# Altium project Tag201_GangProgrammerRev2.PrjPCB
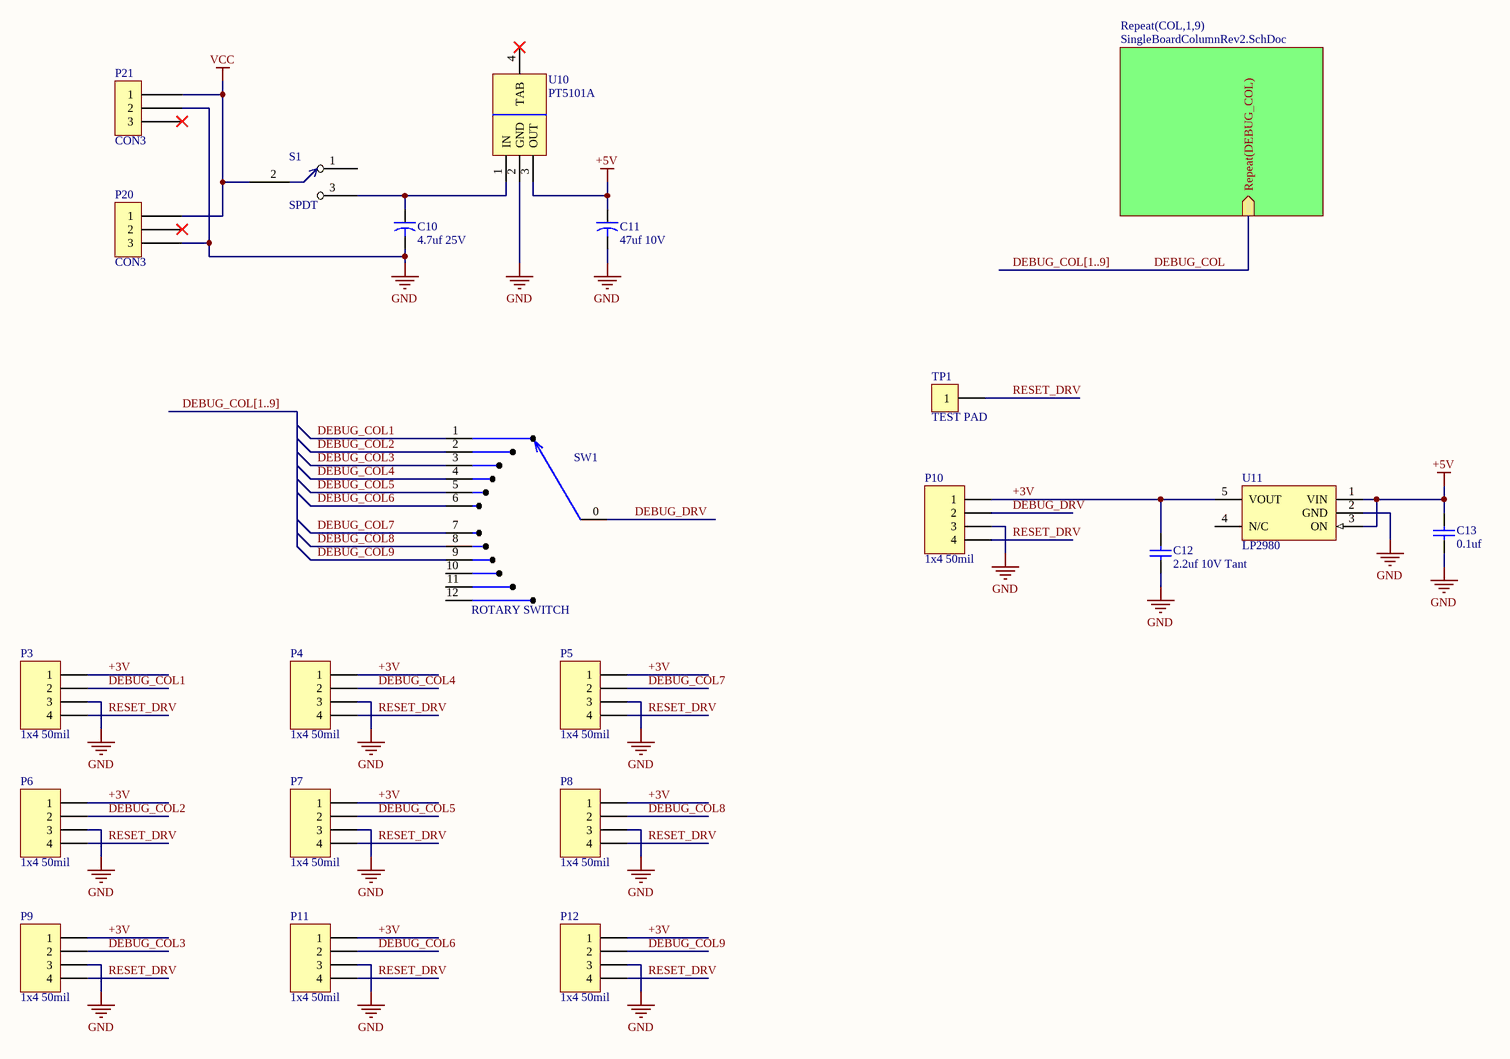
[diagram p0: Tag201_GangProgrammerRev2.SchDoc]
3 sheets, 831 parts. Net scope: hierarchical (ports join the sheet entries above them; power ports are global).
Board file: Tag201_GangProgrammerRev2.PcbDoc
Sheets:
  Tag201_GangProgrammerRev2.SchDoc
    COL1 = SingleBoardColumnRev2.SchDoc
      ROW1 = SingleBoardCircuitRev2.SchDoc
      ROW2 = SingleBoardCircuitRev2.SchDoc
      ROW3 = SingleBoardCircuitRev2.SchDoc
      ROW4 = SingleBoardCircuitRev2.SchDoc
      ROW5 = SingleBoardCircuitRev2.SchDoc
      ROW6 = SingleBoardCircuitRev2.SchDoc
    COL2 = SingleBoardColumnRev2.SchDoc
      ROW1 = SingleBoardCircuitRev2.SchDoc
      ROW2 = SingleBoardCircuitRev2.SchDoc
      ROW3 = SingleBoardCircuitRev2.SchDoc
      ROW4 = SingleBoardCircuitRev2.SchDoc
      ROW5 = SingleBoardCircuitRev2.SchDoc
      ROW6 = SingleBoardCircuitRev2.SchDoc
    COL3 = SingleBoardColumnRev2.SchDoc
      ROW1 = SingleBoardCircuitRev2.SchDoc
      ROW2 = SingleBoardCircuitRev2.SchDoc
      ROW3 = SingleBoardCircuitRev2.SchDoc
      ROW4 = SingleBoardCircuitRev2.SchDoc
      ROW5 = SingleBoardCircuitRev2.SchDoc
      ROW6 = SingleBoardCircuitRev2.SchDoc
    COL4 = SingleBoardColumnRev2.SchDoc
      ROW1 = SingleBoardCircuitRev2.SchDoc
      ROW2 = SingleBoardCircuitRev2.SchDoc
      ROW3 = SingleBoardCircuitRev2.SchDoc
      ROW4 = SingleBoardCircuitRev2.SchDoc
      ROW5 = SingleBoardCircuitRev2.SchDoc
      ROW6 = SingleBoardCircuitRev2.SchDoc
    COL5 = SingleBoardColumnRev2.SchDoc
      ROW1 = SingleBoardCircuitRev2.SchDoc
      ROW2 = SingleBoardCircuitRev2.SchDoc
      ROW3 = SingleBoardCircuitRev2.SchDoc
      ROW4 = SingleBoardCircuitRev2.SchDoc
      ROW5 = SingleBoardCircuitRev2.SchDoc
      ROW6 = SingleBoardCircuitRev2.SchDoc
    COL6 = SingleBoardColumnRev2.SchDoc
      ROW1 = SingleBoardCircuitRev2.SchDoc
      ROW2 = SingleBoardCircuitRev2.SchDoc
      ROW3 = SingleBoardCircuitRev2.SchDoc
      ROW4 = SingleBoardCircuitRev2.SchDoc
      ROW5 = SingleBoardCircuitRev2.SchDoc
      ROW6 = SingleBoardCircuitRev2.SchDoc
    COL7 = SingleBoardColumnRev2.SchDoc
      ROW1 = SingleBoardCircuitRev2.SchDoc
      ROW2 = SingleBoardCircuitRev2.SchDoc
      ROW3 = SingleBoardCircuitRev2.SchDoc
      ROW4 = SingleBoardCircuitRev2.SchDoc
      ROW5 = SingleBoardCircuitRev2.SchDoc
      ROW6 = SingleBoardCircuitRev2.SchDoc
    COL8 = SingleBoardColumnRev2.SchDoc
      ROW1 = SingleBoardCircuitRev2.SchDoc
      ROW2 = SingleBoardCircuitRev2.SchDoc
      ROW3 = SingleBoardCircuitRev2.SchDoc
      ROW4 = SingleBoardCircuitRev2.SchDoc
      ROW5 = SingleBoardCircuitRev2.SchDoc
      ROW6 = SingleBoardCircuitRev2.SchDoc
    COL9 = SingleBoardColumnRev2.SchDoc
      ROW1 = SingleBoardCircuitRev2.SchDoc
      ROW2 = SingleBoardCircuitRev2.SchDoc
      ROW3 = SingleBoardCircuitRev2.SchDoc
      ROW4 = SingleBoardCircuitRev2.SchDoc
      ROW5 = SingleBoardCircuitRev2.SchDoc
      ROW6 = SingleBoardCircuitRev2.SchDoc

## Sheet Tag201_GangProgrammerRev2.SchDoc
size B; Date: 2/10/2009; ApprovedBy: Touraj; DrawnBy: Juan A. Nadal; Engineer: Touraj; Organization: ActiveWave; Address1: 902 Clint Moore Rd., Suite 118; Address2: Boca Raton; Address3: FL, 33487; Address4: 561-999-9422; DocumentNumber: 3; Revision: 21; SheetNumber: 3; SheetTotal: 4; PageSetup: Record=PageOptions|CenterHorizontal=True|CenterVertical=True|PrintScale=0.70|XCorrection=1.00|YCorrection=1.00|PrintKind=0|BorderSize=5000000|LeftOffset=0|BottomOffset=0|Orientation=2|PaperLength=1000|PaperWidth=1000|Scale=100|PaperSource=7|PrintQuality=-4|MediaType=1|DitherType=10|PaperKind=Letter|PrintScaleMode=1; Project: Tag105

### Parts
C10  4.7uf 25V  [CAP C CASE_041412]
C11  47uf 10V  [CAP D CASE_030205]
C12  2.2uf 10V Tant  [CAP A CASE_030205]
C13  0.1uf  [0603_072205]
P3  1x4 50mil  [1X4 HEADER_50mil_071411]
P4  1x4 50mil  [1X4 HEADER_50mil_071411]
P5  1x4 50mil  [1X4 HEADER_50mil_071411]
P6  1x4 50mil  [1X4 HEADER_50mil_071411]
P7  1x4 50mil  [1X4 HEADER_50mil_071411]
P8  1x4 50mil  [1X4 HEADER_50mil_071411]
P9  1x4 50mil  [1X4 HEADER_50mil_071411]
P10  1x4 50mil  [1X4 HEADER_50mil_071411]
P11  1x4 50mil  [1X4 HEADER_50mil_071411]
P12  1x4 50mil  [1X4 HEADER_50mil_071411]
P20  CON3  [POWER JACK_SMALLHOLE_022110]
P21  CON3  [Power Jack_SMT_071312]
S1  SPDT  [CnK_TseriesSPDT_Toggle_040512]
SW1  ROTARY SWITCH  [SWITCH_ROTARY_1P12T_101912]
TP1  TEST PAD  [TestPoint52x32]
U10  PT5101A  [TI_PowerTrendsPT_061812]
U11  LP2980  [SOT25_030205]

### Sub-sheets
Repeat(COL,1,9) = SingleBoardColumnRev2.SchDoc: Repeat(DEBUG_COL) (in)

### Nets
+5V: C11.1 C13.1 U10.3(OUT) U11.1(VIN) U11.3(ON)
GND: C10.2 C11.2 C12.2 C13.2 P3.3 P4.3 P5.3 P6.3 P7.3 P8.3 P9.3 P10.3 P11.3 P12.3 P20.3 P21.2 U10.2(GND) U11.2(GND)
VCC: P20.1 P21.1 S1.2
+3V: C12.1 P3.1 P4.1 P5.1 P6.1 P7.1 P8.1 P9.1 P10.1 P11.1 P12.1 U11.5(VOUT)  [project net +3V_3]
DEBUG_COL: sheet Repeat(COL,1,9)/Repeat(DEBUG_COL)
DEBUG_COL1: P3.2 SW1.1  [project net DEBUG_COL]
DEBUG_COL2: P6.2 SW1.2  [project net DEBUG_COL]
DEBUG_COL3: P9.2 SW1.3  [project net DEBUG_COL]
DEBUG_COL4: P4.2 SW1.4  [project net DEBUG_COL]
DEBUG_COL5: P7.2 SW1.5  [project net DEBUG_COL]
DEBUG_COL6: P11.2 SW1.6  [project net DEBUG_COL]
DEBUG_COL7: P5.2 SW1.7  [project net DEBUG_COL]
DEBUG_COL8: P8.2 SW1.8  [project net DEBUG_COL]
DEBUG_COL9: P12.2 SW1.9  [project net DEBUG_COL]
DEBUG_DRV: P10.2 SW1.0  [project net DEBUG_DRV_3]
RESET_DRV: P3.4 P4.4 P5.4 P6.4 P7.4 P8.4 P9.4 P10.4 P11.4 P12.4 TP1.1  [project net RESET_DRV_3]
NetC10_1: C10.1 S1.3 U10.1(IN)

Not connected (* = marked no-connect by the designer): P20 2*; P21 3*; S1 1; SW1 10 11 12; U10 4(TAB)*; U11 4(N/C)

### Buses and harness runs
bus DEBUG_COL[1..9]

### Notes on the sheet
- APPROVALS
- DATE
- Title:
- Drawn:
- Checked:
- Release:
- Date:
- Size:
- Sheet Name:
- B
- Number:
- Time:
- Revision:
- Sheet
- of
- File:

### Library data of the parts
C10 = Cap2: Capacitor; PARTNO: T491A475M025AT; MAN: Kemet; VALUE: 4.7uf 25V; DK: 399-4630-1-ND
C11 = Cap2: Capacitor; PARTNO: TAJC476K010RNJ; MAN: AVX; VALUE: 47uf 10V; DK: 478-3910-1-ND
C12 = Cap: Capacitor; PARTNO: F931A225MAA; MAN: Nichicon; VALUE: 2.2uf 10V Tant; DK: 493-2356-1-ND
C13 = Cap: Capacitor; PARTNO: C0603C104Z3VACTU; MAN: Kemet; VALUE: 0.1uf; DK: 399-1100-2-ND
P3-P12 = Header 4: Header, 4-Pin; VALUE: 1x4 50mil; DK: 1x4 Header 0.5mil
P20 = CON3: PARTNO: PJ-102A; VALUE: POWER JACK; MAN: CUI; DK: CP-102A-ND
P21 = CON3: PARTNO: PJ-002A-SMT; VALUE: POWER JACK; MAN: CUI; DK: 002APJTR-ND
S1 = SWITCH SPST: PARTNO: T102SHCQE; MAN: C&K; VALUE: SPDT; DK: CKN10151-ND
SW1 = SwitchRotary1P12T: MFG_PN: 51DP30-01-1-AJN; MFG: Grayhill; VALUE: ROTARY SWITCH; SUPPLIER_PN: GH7278-ND; SUPPLIER: DigiKey
TP1 = CON1: Connector; VALUE: TEST PAD; DK: N/A; MAN: N/A; PARTNO: N/A
U10 = LM340T: MAN: PowerTrends; VALUE: PT5101A; DK: PT5101A-ND; PARTNO: PT5101A
U11 = LP2985: PARTNO: LP2980AIM5-3.3/NOPB; MAN: TI / National; VALUE: LP2980; DK: LP2980AIM5-3.3CT-ND

## Sheet SingleBoardColumnRev2.SchDoc
size B; Date: 2/10/2009; ApprovedBy: Touraj; DrawnBy: Juan A. Nadal; Engineer: Touraj; Organization: ActiveWave; Address1: 902 Clint Moore Rd., Suite 118; Address2: Boca Raton; Address3: FL, 33487; Address4: 561-999-9422; DocumentNumber: 3; Revision: 21; SheetNumber: 3; SheetTotal: 4; PageSetup: Record=PageOptions|CenterHorizontal=True|CenterVertical=True|PrintScale=0.70|XCorrection=1.00|YCorrection=1.00|PrintKind=0|BorderSize=5000000|LeftOffset=0|BottomOffset=0|Orientation=2|PaperLength=1000|PaperWidth=1000|Scale=100|PaperSource=7|PrintQuality=-4|MediaType=1|DitherType=10|PaperKind=Letter|PrintScaleMode=1; Project: Tag105
Used 9 times, as channels COL1, COL2, COL3, COL4, COL5, COL6, COL7, COL8, COL9. Parts and nets are listed once, with the designators drawn on the sheet.
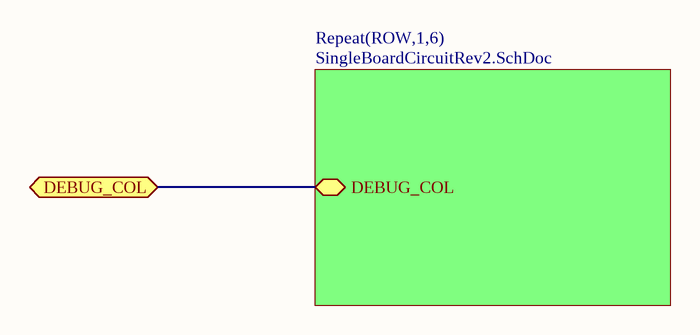
[diagram p1: SingleBoardColumnRev2.SchDoc]

### Sub-sheets
Repeat(ROW,1,6) = SingleBoardCircuitRev2.SchDoc: DEBUG_COL

### Ports
DEBUG_COL (bidir)

### Nets
DEBUG_COL: port DEBUG_COL, sheet Repeat(ROW,1,6)/DEBUG_COL

### Channels
COL1: ports DEBUG_COL=DEBUG_COL
COL2: ports DEBUG_COL=DEBUG_COL
COL3: ports DEBUG_COL=DEBUG_COL
COL4: ports DEBUG_COL=DEBUG_COL
COL5: ports DEBUG_COL=DEBUG_COL
COL6: ports DEBUG_COL=DEBUG_COL
COL7: ports DEBUG_COL=DEBUG_COL
COL8: ports DEBUG_COL=DEBUG_COL
COL9: ports DEBUG_COL=DEBUG_COL

### Notes on the sheet
- APPROVALS
- DATE
- Title:
- Drawn:
- Checked:
- Release:
- Date:
- Size:
- Sheet Name:
- B
- Number:
- Time:
- Revision:
- Sheet
- of
- File:

## Sheet SingleBoardCircuitRev2.SchDoc
size B; Date: 2/10/2009; ApprovedBy: Touraj; DrawnBy: Juan A. Nadal; Engineer: Touraj; Organization: ActiveWave; Address1: 902 Clint Moore Rd., Suite 118; Address2: Boca Raton; Address3: FL, 33487; Address4: 561-999-9422; DocumentNumber: 3; Revision: 21; SheetNumber: 3; SheetTotal: 4; PageSetup: Record=PageOptions|CenterHorizontal=True|CenterVertical=True|PrintScale=0.70|XCorrection=1.00|YCorrection=1.00|PrintKind=0|BorderSize=5000000|LeftOffset=0|BottomOffset=0|Orientation=2|PaperLength=1000|PaperWidth=1000|Scale=100|PaperSource=7|PrintQuality=-4|MediaType=1|DitherType=10|PaperKind=Letter|PrintScaleMode=1; Project: Tag105
Used 54 times, as channels COL1/ROW1, COL1/ROW2, COL1/ROW3, COL1/ROW4, COL1/ROW5, COL1/ROW6, COL2/ROW1, COL2/ROW2, COL2/ROW3, COL2/ROW4, COL2/ROW5, COL2/ROW6, COL3/ROW1, COL3/ROW2, COL3/ROW3, COL3/ROW4, COL3/ROW5, COL3/ROW6, COL4/ROW1, COL4/ROW2, COL4/ROW3, COL4/ROW4, COL4/ROW5, COL4/ROW6, COL5/ROW1, COL5/ROW2, COL5/ROW3, COL5/ROW4, COL5/ROW5, COL5/ROW6, COL6/ROW1, COL6/ROW2, COL6/ROW3, COL6/ROW4, COL6/ROW5, COL6/ROW6, COL7/ROW1, COL7/ROW2, COL7/ROW3, COL7/ROW4, COL7/ROW5, COL7/ROW6, COL8/ROW1, COL8/ROW2, COL8/ROW3, COL8/ROW4, COL8/ROW5, COL8/ROW6, COL9/ROW1, COL9/ROW2, COL9/ROW3, COL9/ROW4, COL9/ROW5, COL9/ROW6. Parts and nets are listed once, with the designators drawn on the sheet.
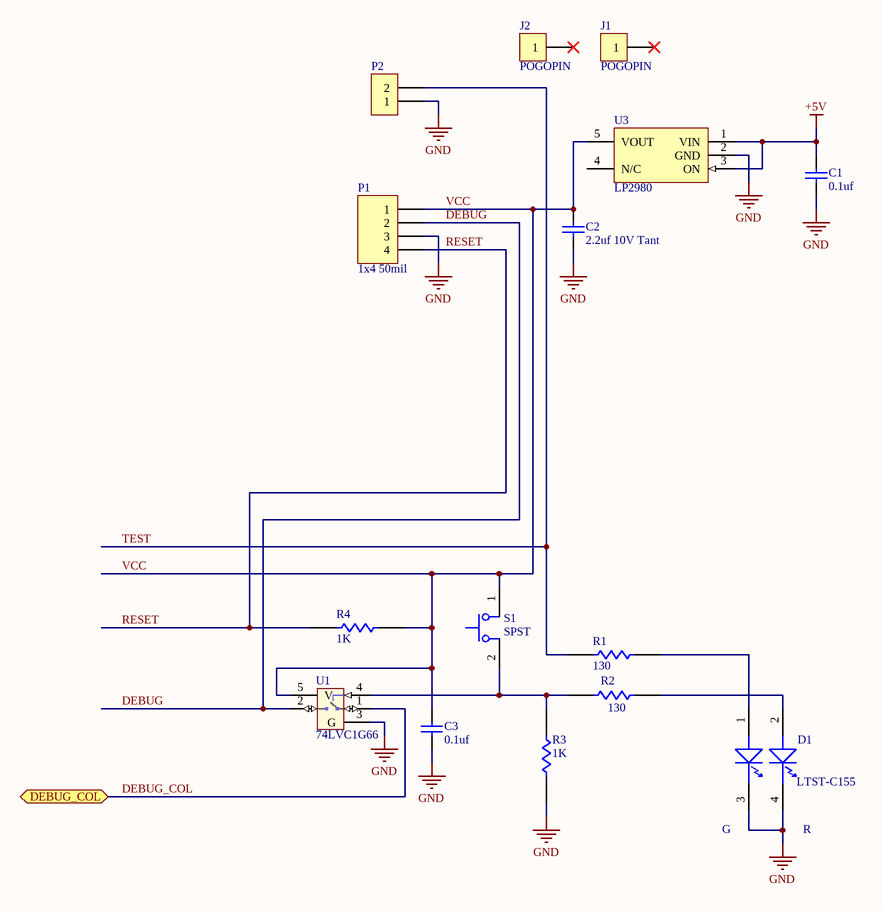
[diagram p2: SingleBoardCircuitRev2.SchDoc]

### Parts
C1  0.1uf  [0603_072205]
C2  2.2uf 10V Tant  [CAP A CASE_030205]
C3  0.1uf  [0603_072205]
D1  LTST-C155  [LED 5mm x 2.5mm_061112]
J1  POGOPIN  [TestPoint52x32]
J2  POGOPIN  [TestPoint52x32]
P1  1x4 50mil  [1X4 HEADER_50mil_071411]
P2  1x2 50mil  [1X2 HEADER_50MIL_081611]  (value not drawn)
R1  130  [0603_072205]
R2  130  [0603_072205]
R3  1K  [0603_072205]
R4  1K  [0603_072205]
S1  SPST  [SwitchDPDT_6_061412]
U1  74LVC1G66  [SOT25_030205]
U3  LP2980  [SOT25_030205]

### Ports
DEBUG_COL (bidir)

### Nets
+5V: C1.1 U3.1(VIN) U3.3(ON)
GND: C1.2 C2.2 C3.2 D1.3(K) D1.4(K) P1.3 P2.1 R3.1 U1.3(G) U3.2(GND)
DEBUG: P1.2 U1.2(OUTY)  [project net DEBUG_3]
DEBUG_COL: U1.1(INA) ; port DEBUG_COL
RESET: P1.4 R4.1  [project net RESET_3]
TEST: P2.2 R1.2  [project net TEST_3]
VCC: C2.1 C3.1 P1.1 R4.2 S1.1 U1.5(V) U3.5(VOUT)  [project net VCC_3]
NetD1_1: D1.1(G) R1.1
NetD1_2: D1.2(R) R2.1
NetR2_2: R2.2 R3.2 S1.2 U1.4(EN)

Not connected (* = marked no-connect by the designer): J1 1*; J2 1*; U3 4(N/C)

### Channels
COL1/ROW1: designators end in _COL1_ROW1; ports DEBUG_COL=DEBUG_COL
COL1/ROW2: designators end in _COL1_ROW2; ports DEBUG_COL=DEBUG_COL
COL1/ROW3: designators end in _COL1_ROW3; ports DEBUG_COL=DEBUG_COL
COL1/ROW4: designators end in _COL1_ROW4; ports DEBUG_COL=DEBUG_COL
COL1/ROW5: designators end in _COL1_ROW5; ports DEBUG_COL=DEBUG_COL
COL1/ROW6: designators end in _COL1_ROW6; ports DEBUG_COL=DEBUG_COL
COL2/ROW1: designators end in _COL2_ROW1; ports DEBUG_COL=DEBUG_COL
COL2/ROW2: designators end in _COL2_ROW2; ports DEBUG_COL=DEBUG_COL
COL2/ROW3: designators end in _COL2_ROW3; ports DEBUG_COL=DEBUG_COL
COL2/ROW4: designators end in _COL2_ROW4; ports DEBUG_COL=DEBUG_COL
COL2/ROW5: designators end in _COL2_ROW5; ports DEBUG_COL=DEBUG_COL
COL2/ROW6: designators end in _COL2_ROW6; ports DEBUG_COL=DEBUG_COL
COL3/ROW1: designators end in _COL3_ROW1; ports DEBUG_COL=DEBUG_COL
COL3/ROW2: designators end in _COL3_ROW2; ports DEBUG_COL=DEBUG_COL
COL3/ROW3: designators end in _COL3_ROW3; ports DEBUG_COL=DEBUG_COL
COL3/ROW4: designators end in _COL3_ROW4; ports DEBUG_COL=DEBUG_COL
COL3/ROW5: designators end in _COL3_ROW5; ports DEBUG_COL=DEBUG_COL
COL3/ROW6: designators end in _COL3_ROW6; ports DEBUG_COL=DEBUG_COL
COL4/ROW1: designators end in _COL4_ROW1; ports DEBUG_COL=DEBUG_COL
COL4/ROW2: designators end in _COL4_ROW2; ports DEBUG_COL=DEBUG_COL
COL4/ROW3: designators end in _COL4_ROW3; ports DEBUG_COL=DEBUG_COL
COL4/ROW4: designators end in _COL4_ROW4; ports DEBUG_COL=DEBUG_COL
COL4/ROW5: designators end in _COL4_ROW5; ports DEBUG_COL=DEBUG_COL
COL4/ROW6: designators end in _COL4_ROW6; ports DEBUG_COL=DEBUG_COL
COL5/ROW1: designators end in _COL5_ROW1; ports DEBUG_COL=DEBUG_COL
COL5/ROW2: designators end in _COL5_ROW2; ports DEBUG_COL=DEBUG_COL
COL5/ROW3: designators end in _COL5_ROW3; ports DEBUG_COL=DEBUG_COL
COL5/ROW4: designators end in _COL5_ROW4; ports DEBUG_COL=DEBUG_COL
COL5/ROW5: designators end in _COL5_ROW5; ports DEBUG_COL=DEBUG_COL
COL5/ROW6: designators end in _COL5_ROW6; ports DEBUG_COL=DEBUG_COL
COL6/ROW1: designators end in _COL6_ROW1; ports DEBUG_COL=DEBUG_COL
COL6/ROW2: designators end in _COL6_ROW2; ports DEBUG_COL=DEBUG_COL
COL6/ROW3: designators end in _COL6_ROW3; ports DEBUG_COL=DEBUG_COL
COL6/ROW4: designators end in _COL6_ROW4; ports DEBUG_COL=DEBUG_COL
COL6/ROW5: designators end in _COL6_ROW5; ports DEBUG_COL=DEBUG_COL
COL6/ROW6: designators end in _COL6_ROW6; ports DEBUG_COL=DEBUG_COL
COL7/ROW1: designators end in _COL7_ROW1; ports DEBUG_COL=DEBUG_COL
COL7/ROW2: designators end in _COL7_ROW2; ports DEBUG_COL=DEBUG_COL
COL7/ROW3: designators end in _COL7_ROW3; ports DEBUG_COL=DEBUG_COL
COL7/ROW4: designators end in _COL7_ROW4; ports DEBUG_COL=DEBUG_COL
COL7/ROW5: designators end in _COL7_ROW5; ports DEBUG_COL=DEBUG_COL
COL7/ROW6: designators end in _COL7_ROW6; ports DEBUG_COL=DEBUG_COL
COL8/ROW1: designators end in _COL8_ROW1; ports DEBUG_COL=DEBUG_COL
COL8/ROW2: designators end in _COL8_ROW2; ports DEBUG_COL=DEBUG_COL
COL8/ROW3: designators end in _COL8_ROW3; ports DEBUG_COL=DEBUG_COL
COL8/ROW4: designators end in _COL8_ROW4; ports DEBUG_COL=DEBUG_COL
COL8/ROW5: designators end in _COL8_ROW5; ports DEBUG_COL=DEBUG_COL
COL8/ROW6: designators end in _COL8_ROW6; ports DEBUG_COL=DEBUG_COL
COL9/ROW1: designators end in _COL9_ROW1; ports DEBUG_COL=DEBUG_COL
COL9/ROW2: designators end in _COL9_ROW2; ports DEBUG_COL=DEBUG_COL
COL9/ROW3: designators end in _COL9_ROW3; ports DEBUG_COL=DEBUG_COL
COL9/ROW4: designators end in _COL9_ROW4; ports DEBUG_COL=DEBUG_COL
COL9/ROW5: designators end in _COL9_ROW5; ports DEBUG_COL=DEBUG_COL
COL9/ROW6: designators end in _COL9_ROW6; ports DEBUG_COL=DEBUG_COL

### Notes on the sheet
- (near D1) G
- (near D1) R
- APPROVALS
- DATE
- Title:
- Drawn:
- Checked:
- Release:
- Date:
- Size:
- Sheet Name:
- B
- Number:
- Time:
- Revision:
- Sheet
- of
- File:

### Library data of the parts
C1 C3 = Cap: as C13 on sheet Tag201_GangProgrammerRev2; VALUE: 0.1uf; DK: 399-1100-2-ND
C2 = Cap: as C12 on sheet Tag201_GangProgrammerRev2; VALUE: 2.2uf 10V Tant; DK: 493-2356-1-ND
D1 = LED_BI_2_1: PARTNO: LTST-C155GEKT; VALUE: LTST-C155; DK: 160-1172-2-ND
J1 J2 = CON1: Connector; VALUE: POGOPIN; DK: N/A; MAN: N/A; PARTNO: N/A
P1 = Header 4: Header, 4-Pin; VALUE: 1x4 50mil; DK: 4 PogoPins
P2 = CON2: DK: 2 PogoPins; VALUE: 1x2 50mil
R1 R2 = RESISTOR: PARTNO: MCR03EZPFX1300; MAN: Rohm; VALUE: 130; DK: RHM130HTR-ND
R3 R4 = RESISTOR: PARTNO: MCR03EZPFX1001; MAN: Rohm; VALUE: 1K; DK: RHM1.00KHTR-ND
S1 = SWITCH PB: PARTNO: PVA2 EE H1; VALUE: SPST; DK: 401-1140-ND
U1 = 7466_SINGLE: Single Solid State Switch; PARTNO: SN74LVC1G66DBVR; VALUE: 74LVC1G66; DK: 296-13253-1-ND
U3 = LP2985: as U11 on sheet Tag201_GangProgrammerRev2; VALUE: LP2980; DK: LP2980AIM5-3.3CT-ND

## Nets that join several sheets
+5V: Tag201_GangProgrammerRev2 (5 pins), COL1/ROW1 (C1_COL1_ROW1.1 U3_COL1_ROW1.1 U3_COL1_ROW1.3), COL1/ROW2 (C1_COL1_ROW2.1 U3_COL1_ROW2.1 U3_COL1_ROW2.3), COL1/ROW3 (C1_COL1_ROW3.1 U3_COL1_ROW3.1 U3_COL1_ROW3.3), COL1/ROW4 (C1_COL1_ROW4.1 U3_COL1_ROW4.1 U3_COL1_ROW4.3), COL1/ROW5 (C1_COL1_ROW5.1 U3_COL1_ROW5.1 U3_COL1_ROW5.3), COL1/ROW6 (C1_COL1_ROW6.1 U3_COL1_ROW6.1 U3_COL1_ROW6.3), COL2/ROW1 (C1_COL2_ROW1.1 U3_COL2_ROW1.1 U3_COL2_ROW1.3), COL2/ROW2 (C1_COL2_ROW2.1 U3_COL2_ROW2.1 U3_COL2_ROW2.3), COL2/ROW3 (C1_COL2_ROW3.1 U3_COL2_ROW3.1 U3_COL2_ROW3.3), COL2/ROW4 (C1_COL2_ROW4.1 U3_COL2_ROW4.1 U3_COL2_ROW4.3), COL2/ROW5 (C1_COL2_ROW5.1 U3_COL2_ROW5.1 U3_COL2_ROW5.3), COL2/ROW6 (C1_COL2_ROW6.1 U3_COL2_ROW6.1 U3_COL2_ROW6.3), COL3/ROW1 (C1_COL3_ROW1.1 U3_COL3_ROW1.1 U3_COL3_ROW1.3), COL3/ROW2 (C1_COL3_ROW2.1 U3_COL3_ROW2.1 U3_COL3_ROW2.3), COL3/ROW3 (C1_COL3_ROW3.1 U3_COL3_ROW3.1 U3_COL3_ROW3.3), COL3/ROW4 (C1_COL3_ROW4.1 U3_COL3_ROW4.1 U3_COL3_ROW4.3), COL3/ROW5 (C1_COL3_ROW5.1 U3_COL3_ROW5.1 U3_COL3_ROW5.3), COL3/ROW6 (C1_COL3_ROW6.1 U3_COL3_ROW6.1 U3_COL3_ROW6.3), COL4/ROW1 (C1_COL4_ROW1.1 U3_COL4_ROW1.1 U3_COL4_ROW1.3), COL4/ROW2 (C1_COL4_ROW2.1 U3_COL4_ROW2.1 U3_COL4_ROW2.3), COL4/ROW3 (C1_COL4_ROW3.1 U3_COL4_ROW3.1 U3_COL4_ROW3.3), COL4/ROW4 (C1_COL4_ROW4.1 U3_COL4_ROW4.1 U3_COL4_ROW4.3), COL4/ROW5 (C1_COL4_ROW5.1 U3_COL4_ROW5.1 U3_COL4_ROW5.3), COL4/ROW6 (C1_COL4_ROW6.1 U3_COL4_ROW6.1 U3_COL4_ROW6.3), COL5/ROW1 (C1_COL5_ROW1.1 U3_COL5_ROW1.1 U3_COL5_ROW1.3), COL5/ROW2 (C1_COL5_ROW2.1 U3_COL5_ROW2.1 U3_COL5_ROW2.3), COL5/ROW3 (C1_COL5_ROW3.1 U3_COL5_ROW3.1 U3_COL5_ROW3.3), COL5/ROW4 (C1_COL5_ROW4.1 U3_COL5_ROW4.1 U3_COL5_ROW4.3), COL5/ROW5 (C1_COL5_ROW5.1 U3_COL5_ROW5.1 U3_COL5_ROW5.3), COL5/ROW6 (C1_COL5_ROW6.1 U3_COL5_ROW6.1 U3_COL5_ROW6.3), COL6/ROW1 (C1_COL6_ROW1.1 U3_COL6_ROW1.1 U3_COL6_ROW1.3), COL6/ROW2 (C1_COL6_ROW2.1 U3_COL6_ROW2.1 U3_COL6_ROW2.3), COL6/ROW3 (C1_COL6_ROW3.1 U3_COL6_ROW3.1 U3_COL6_ROW3.3), COL6/ROW4 (C1_COL6_ROW4.1 U3_COL6_ROW4.1 U3_COL6_ROW4.3), COL6/ROW5 (C1_COL6_ROW5.1 U3_COL6_ROW5.1 U3_COL6_ROW5.3), COL6/ROW6 (C1_COL6_ROW6.1 U3_COL6_ROW6.1 U3_COL6_ROW6.3), COL7/ROW1 (C1_COL7_ROW1.1 U3_COL7_ROW1.1 U3_COL7_ROW1.3), COL7/ROW2 (C1_COL7_ROW2.1 U3_COL7_ROW2.1 U3_COL7_ROW2.3), COL7/ROW3 (C1_COL7_ROW3.1 U3_COL7_ROW3.1 U3_COL7_ROW3.3), COL7/ROW4 (C1_COL7_ROW4.1 U3_COL7_ROW4.1 U3_COL7_ROW4.3), COL7/ROW5 (C1_COL7_ROW5.1 U3_COL7_ROW5.1 U3_COL7_ROW5.3), COL7/ROW6 (C1_COL7_ROW6.1 U3_COL7_ROW6.1 U3_COL7_ROW6.3), COL8/ROW1 (C1_COL8_ROW1.1 U3_COL8_ROW1.1 U3_COL8_ROW1.3), COL8/ROW2 (C1_COL8_ROW2.1 U3_COL8_ROW2.1 U3_COL8_ROW2.3), COL8/ROW3 (C1_COL8_ROW3.1 U3_COL8_ROW3.1 U3_COL8_ROW3.3), COL8/ROW4 (C1_COL8_ROW4.1 U3_COL8_ROW4.1 U3_COL8_ROW4.3), COL8/ROW5 (C1_COL8_ROW5.1 U3_COL8_ROW5.1 U3_COL8_ROW5.3), COL8/ROW6 (C1_COL8_ROW6.1 U3_COL8_ROW6.1 U3_COL8_ROW6.3), COL9/ROW1 (C1_COL9_ROW1.1 U3_COL9_ROW1.1 U3_COL9_ROW1.3), COL9/ROW2 (C1_COL9_ROW2.1 U3_COL9_ROW2.1 U3_COL9_ROW2.3), COL9/ROW3 (C1_COL9_ROW3.1 U3_COL9_ROW3.1 U3_COL9_ROW3.3), COL9/ROW4 (C1_COL9_ROW4.1 U3_COL9_ROW4.1 U3_COL9_ROW4.3), COL9/ROW5 (C1_COL9_ROW5.1 U3_COL9_ROW5.1 U3_COL9_ROW5.3), COL9/ROW6 (C1_COL9_ROW6.1 U3_COL9_ROW6.1 U3_COL9_ROW6.3)
GND: Tag201_GangProgrammerRev2 (18 pins), COL1/ROW1 (10 pins), COL1/ROW2 (10 pins), COL1/ROW3 (10 pins), COL1/ROW4 (10 pins), COL1/ROW5 (10 pins), COL1/ROW6 (10 pins), COL2/ROW1 (10 pins), COL2/ROW2 (10 pins), COL2/ROW3 (10 pins), COL2/ROW4 (10 pins), COL2/ROW5 (10 pins), COL2/ROW6 (10 pins), COL3/ROW1 (10 pins), COL3/ROW2 (10 pins), COL3/ROW3 (10 pins), COL3/ROW4 (10 pins), COL3/ROW5 (10 pins), COL3/ROW6 (10 pins), COL4/ROW1 (10 pins), COL4/ROW2 (10 pins), COL4/ROW3 (10 pins), COL4/ROW4 (10 pins), COL4/ROW5 (10 pins), COL4/ROW6 (10 pins), COL5/ROW1 (10 pins), COL5/ROW2 (10 pins), COL5/ROW3 (10 pins), COL5/ROW4 (10 pins), COL5/ROW5 (10 pins), COL5/ROW6 (10 pins), COL6/ROW1 (10 pins), COL6/ROW2 (10 pins), COL6/ROW3 (10 pins), COL6/ROW4 (10 pins), COL6/ROW5 (10 pins), COL6/ROW6 (10 pins), COL7/ROW1 (10 pins), COL7/ROW2 (10 pins), COL7/ROW3 (10 pins), COL7/ROW4 (10 pins), COL7/ROW5 (10 pins), COL7/ROW6 (10 pins), COL8/ROW1 (10 pins), COL8/ROW2 (10 pins), COL8/ROW3 (10 pins), COL8/ROW4 (10 pins), COL8/ROW5 (10 pins), COL8/ROW6 (10 pins), COL9/ROW1 (10 pins), COL9/ROW2 (10 pins), COL9/ROW3 (10 pins), COL9/ROW4 (10 pins), COL9/ROW5 (10 pins), COL9/ROW6 (10 pins)
DEBUG_COL: Tag201_GangProgrammerRev2 (P3.2 SW1.1), COL1/ROW1 (U1_COL1_ROW1.1), COL1/ROW2 (U1_COL1_ROW2.1), COL1/ROW3 (U1_COL1_ROW3.1), COL1/ROW4 (U1_COL1_ROW4.1), COL1/ROW5 (U1_COL1_ROW5.1), COL1/ROW6 (U1_COL1_ROW6.1)
DEBUG_COL: Tag201_GangProgrammerRev2 (P6.2 SW1.2), COL2/ROW1 (U1_COL2_ROW1.1), COL2/ROW2 (U1_COL2_ROW2.1), COL2/ROW3 (U1_COL2_ROW3.1), COL2/ROW4 (U1_COL2_ROW4.1), COL2/ROW5 (U1_COL2_ROW5.1), COL2/ROW6 (U1_COL2_ROW6.1)
DEBUG_COL: Tag201_GangProgrammerRev2 (P9.2 SW1.3), COL3/ROW1 (U1_COL3_ROW1.1), COL3/ROW2 (U1_COL3_ROW2.1), COL3/ROW3 (U1_COL3_ROW3.1), COL3/ROW4 (U1_COL3_ROW4.1), COL3/ROW5 (U1_COL3_ROW5.1), COL3/ROW6 (U1_COL3_ROW6.1)
DEBUG_COL: Tag201_GangProgrammerRev2 (P4.2 SW1.4), COL4/ROW1 (U1_COL4_ROW1.1), COL4/ROW2 (U1_COL4_ROW2.1), COL4/ROW3 (U1_COL4_ROW3.1), COL4/ROW4 (U1_COL4_ROW4.1), COL4/ROW5 (U1_COL4_ROW5.1), COL4/ROW6 (U1_COL4_ROW6.1)
DEBUG_COL: Tag201_GangProgrammerRev2 (P7.2 SW1.5), COL5/ROW1 (U1_COL5_ROW1.1), COL5/ROW2 (U1_COL5_ROW2.1), COL5/ROW3 (U1_COL5_ROW3.1), COL5/ROW4 (U1_COL5_ROW4.1), COL5/ROW5 (U1_COL5_ROW5.1), COL5/ROW6 (U1_COL5_ROW6.1)
DEBUG_COL: Tag201_GangProgrammerRev2 (P11.2 SW1.6), COL6/ROW1 (U1_COL6_ROW1.1), COL6/ROW2 (U1_COL6_ROW2.1), COL6/ROW3 (U1_COL6_ROW3.1), COL6/ROW4 (U1_COL6_ROW4.1), COL6/ROW5 (U1_COL6_ROW5.1), COL6/ROW6 (U1_COL6_ROW6.1)
DEBUG_COL: Tag201_GangProgrammerRev2 (P5.2 SW1.7), COL7/ROW1 (U1_COL7_ROW1.1), COL7/ROW2 (U1_COL7_ROW2.1), COL7/ROW3 (U1_COL7_ROW3.1), COL7/ROW4 (U1_COL7_ROW4.1), COL7/ROW5 (U1_COL7_ROW5.1), COL7/ROW6 (U1_COL7_ROW6.1)
DEBUG_COL: Tag201_GangProgrammerRev2 (P8.2 SW1.8), COL8/ROW1 (U1_COL8_ROW1.1), COL8/ROW2 (U1_COL8_ROW2.1), COL8/ROW3 (U1_COL8_ROW3.1), COL8/ROW4 (U1_COL8_ROW4.1), COL8/ROW5 (U1_COL8_ROW5.1), COL8/ROW6 (U1_COL8_ROW6.1)
DEBUG_COL: Tag201_GangProgrammerRev2 (P12.2 SW1.9), COL9/ROW1 (U1_COL9_ROW1.1), COL9/ROW2 (U1_COL9_ROW2.1), COL9/ROW3 (U1_COL9_ROW3.1), COL9/ROW4 (U1_COL9_ROW4.1), COL9/ROW5 (U1_COL9_ROW5.1), COL9/ROW6 (U1_COL9_ROW6.1)